# Altium schematic sheet Sheet1.SchDoc
size A; SheetNumber: 1; SheetTotal: 1
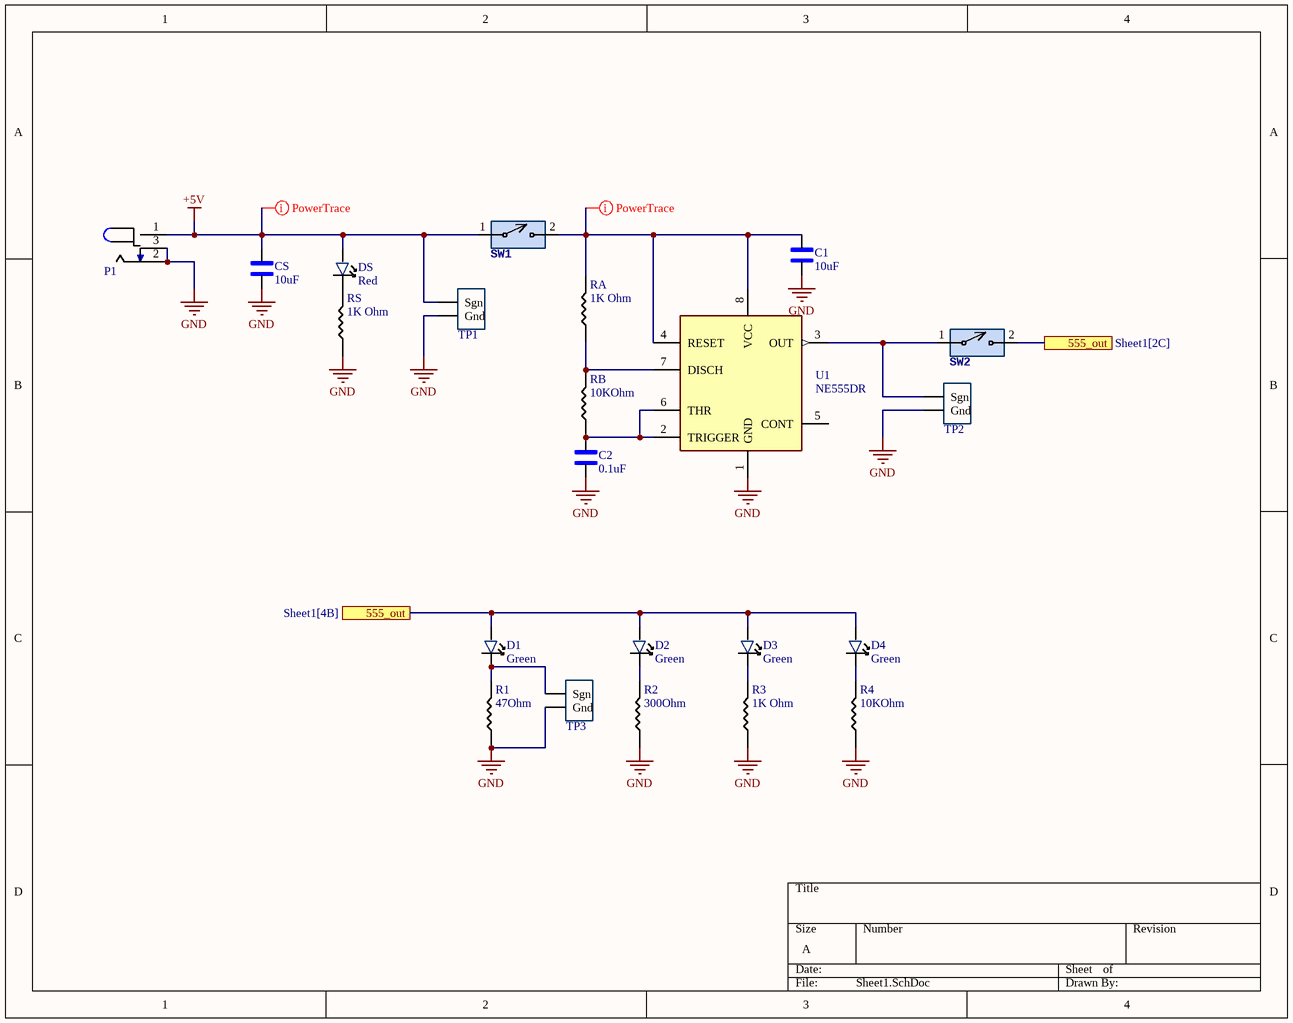
[diagram p0: Sheet1.SchDoc]

## Parts
C1  10uF  [1206_Passive_Capacitor]
C2  0.1uF  [1206_Passive_Capacitor]
CS  10uF  [1206_Passive_Capacitor]
D1  Green  [LED_1206]
D2  Green  [LED_1206]
D3  Green  [LED_1206]
D4  Green  [LED_1206]
DS  Red  [LED_1206]
P1  Power Jack  [Power_Jack]  (value not drawn)
R1  value 47Ohm  [1206_Passive_Resitor]  (hidden comment: 47 Ohms)
R2  value 300Ohm  [1206_Passive_Resitor]  (hidden comment: 300 Ohm)
R3  value 1K Ohm  [1206_Passive_Resitor]  (hidden comment: 1k)
R4  value 10KOhm  [1206_Passive_Resitor]  (hidden comment: 10k)
RA  value 1K Ohm  [1206_Passive_Resitor]  (hidden comment: 1k)
RB  value 10KOhm  [1206_Passive_Resitor]  (hidden comment: 10k)
RS  value 1K Ohm  [1206_Passive_Resitor]  (hidden comment: 1k)
SW1  SW_2Pin_100mil_Switch  [2Pin-Header-Conn]  (value not drawn)
SW2  SW_2Pin_100mil_Switch  [2Pin-Header-Conn]  (value not drawn)
TP1  10x Probe TP  [TP10x_Probe]  (value not drawn)
TP2  10x Probe TP  [TP10x_Probe]  (value not drawn)
TP3  10x Probe TP  [TP10x_Probe]  (value not drawn)
U1  NE555DR  [TS555IDTTR]

## Ports
555_out (see Sheet1[2C]), 555_out (see Sheet1[4B])

## Nets
+5V: CS.2 DS.1 P1.1 SW1.1 TP1.1(Sgn)
GND: C1.1 C2.2 CS.1 P1.2 P1.3 R1.1 R2.1 R3.1 R4.1 RS.1 TP1.2(Gnd) TP2.2(Gnd) TP3.2(Gnd) U1.1(GND)
555_out: D1.1 D2.1 D3.1 D4.1 SW2.2 ; port 555_out
NetC1_2: C1.2 RA.2 SW1.2 U1.4(RESET) U1.8(VCC)
NetC2_1: C2.1 RB.1 U1.2(TRIGGER) U1.6(THR)
NetD1_2: D1.2 R1.2 TP3.1(Sgn)
NetD2_2: D2.2 R2.2
NetD3_2: D3.2 R3.2
NetD4_2: D4.2 R4.2
NetDS_2: DS.2 RS.2
NetRA_1: RA.1 RB.2 U1.7(DISCH)
NetSW2_1: SW2.1 TP2.1(Sgn) U1.3(OUT)

Not connected (* = marked no-connect by the designer): U1 5(CONT)

## Layout directives
rule Width Constraint [Pref Width = 20mil    Min Width = 10mil    Max Width = 50mil]: +5V, NetC1_2

## Library data of the parts
C1 = C_10uF_1206: 10uF ±10% 50V X5R 1206 Multilayer Ceramic Capacitors MLCC - SMD/SMT RoHS; MFR Part #: CL31A106KBHNNNE; Type: Basic; LCSC Part#: C13585; Datasheet: https://datasheet.lcsc.com/lcsc/1810221112_Samsung-Electro-Mechanics-CL31A106KBHNNNE_C13585.pdf; Value: 10uF
C2 = C_1uF_1206: MULTILAYER CERAMIC CAPACITORS MLCC - SMD/SMT 1UF 50V 1206 ROHS; MFR Part #: CL31B105KBHNNNE; Type: Basic; Digikey Link: https://www.digikey.com/product-detail/en/C1206C105M4RACTU/399-8150-1-ND/3471873/?itemSeq=304982366; LCSC Part#: C1848; Value: 0.1uF
CS = C_10uF_1206: 10uF ±10% 50V X5R 1206 Multilayer Ceramic Capacitors MLCC - SMD/SMT RoHS; MFR Part #: CL31A106KBHNNNE; LCSC Part#: C13585; Datasheet: https://datasheet.lcsc.com/lcsc/1810221112_Samsung-Electro-Mechanics-CL31A106KBHNNNE_C13585.pdf; Type: Basic; Value: 10uF
D1-D4 = LED_GREEN_1206: Green 513~528nm 1206 Light Emitting Diodes (LED) RoHS; MFR Part #: SZYY1206G; Type: Extended; LCSC Part#: C434439; Datasheet: https://datasheet.lcsc.com/lcsc/2006301532_Yongyu-Photoelectric-SZYY1206G_C434439.pdf; Value: Green
DS = LED_RED_1206: Red 621~631nm 1206 Light Emitting Diodes (LED) RoHS; MFR Part #: 15-21/R6C-FQ1R1B/2T; LCSC Part#: C93133; Type: Extended; Datasheet: https://datasheet.lcsc.com/szlcsc/1811151241_Everlight-Elec-15-21-R6C-FQ1R1B-2T_C93133.pdf; Value: Red
P1 = P_Power Jack: Power Barrel Connector Jack 2.10mm ID (0.083"), 5.50mm OD (0.217") Through Hole, Right Angle; MFR Part #: PJ-102A; Value: CONN PWR JACK 2X5.5MM SOLDER; Digikey Link: https://www.digikey.com/product-detail/en/PJ-102A/CP-102A-ND/275425/?itemSeq=304982367; LCSC Part#: C136744; Type: Extended
R1 = R_47Ohm_1206: 47Ω ±5% 0.25W ±200ppm/℃ 1206 Chip Resistor - Surface Mount RoHS; MFR Part #: 1206W4J0470T5E; LCSC Part#: C25384; Type: Extended; Datasheet: https://datasheet.lcsc.com/lcsc/1811101020_UNI-ROYAL-Uniroyal-Elec-1206W4J0470T5E_C25384.pdf
R2 = R_300Ohm_1206: CHIP RESISTOR - SURFACE MOUNT 300OHMS ±1% 1/4W 1206 ROHS; MFR Part #: 1206W4F3000T5E; Datasheet: https://datasheet.lcsc.com/szlcsc/Uniroyal-Elec-1206W4F3000T5E_C17887.pdf; LCSC Part#: C17887; Type: Basic
R3 RA RS = R_1K_1206: CHIP RESISTOR - SURFACE MOUNT 1KOHMS ±1% 1/4W 1206 ROHS; MFR Part #: RNCP1206FTD1K00CT; Digikey Link: https://www.digikey.com/product-detail/en/RNCP1206FTD1K00/RNCP1206FTD1K00CT-ND/2240675/?itemSeq=304982373; LCSC Part#: C4410; Type: Basic
R4 RB = R_10KOhm_1206: 10 kOhms ±5% 0.25W, 1/4W Chip Resistor 1206 (3216 Metric) Automotive AEC-Q200 Thick Film; MFR Part #: RMCF1206FT10K0; Digikey Link: https://www.digikey.com/en/products/detail/stackpole-electronics-inc/RMCF1206FT10K0/1759669; LCSC Part#: C17902; Type: Basic
SW1 SW2 = SW_2Pin_100mil_Switch: 2Pin Header; LCSC Part#: C124375; Type: Extended
TP1-TP3 = TP_10x_Probe: Test Point 300 mil centers
U1 = U_555_Slow: 555 Timer SOIC-8_150MIL ROHS 150ns Rise Time; MFR Part #: NE555DR; Digikey Link: https://www.digikey.com/product-detail/en/texas-instruments/NE555DR/296-6501-1-ND/372490; Type: Basic; LCSC Part#: C7593